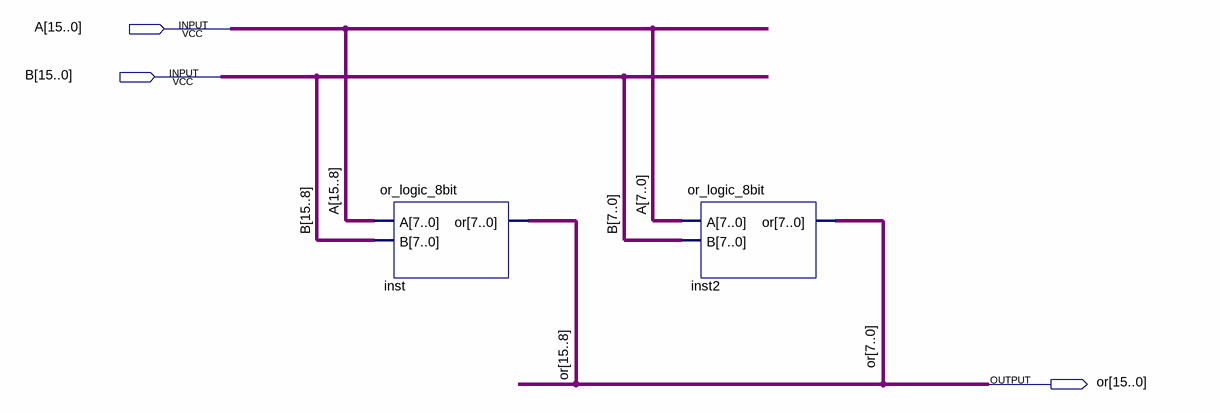
[diagram p0: schematic sheet]
// Quartus schematic or_logic16bit.bdf as structural Verilog: 2 symbols, 3 pins
module or_logic16bit (
  input  [15:0] A,
  input  [15:0] B,
  output [15:0] \or 
);

  or_logic_8bit inst (.A(A[15:8]), .B(B[15:8]), .\or (\or [15:8]));
  or_logic_8bit inst2 (.A(A[7:0]), .B(B[7:0]), .\or (\or [7:0]));
endmodule
